# EAGLE design rgb_test_board_1 (EAGLE 9.5.2)
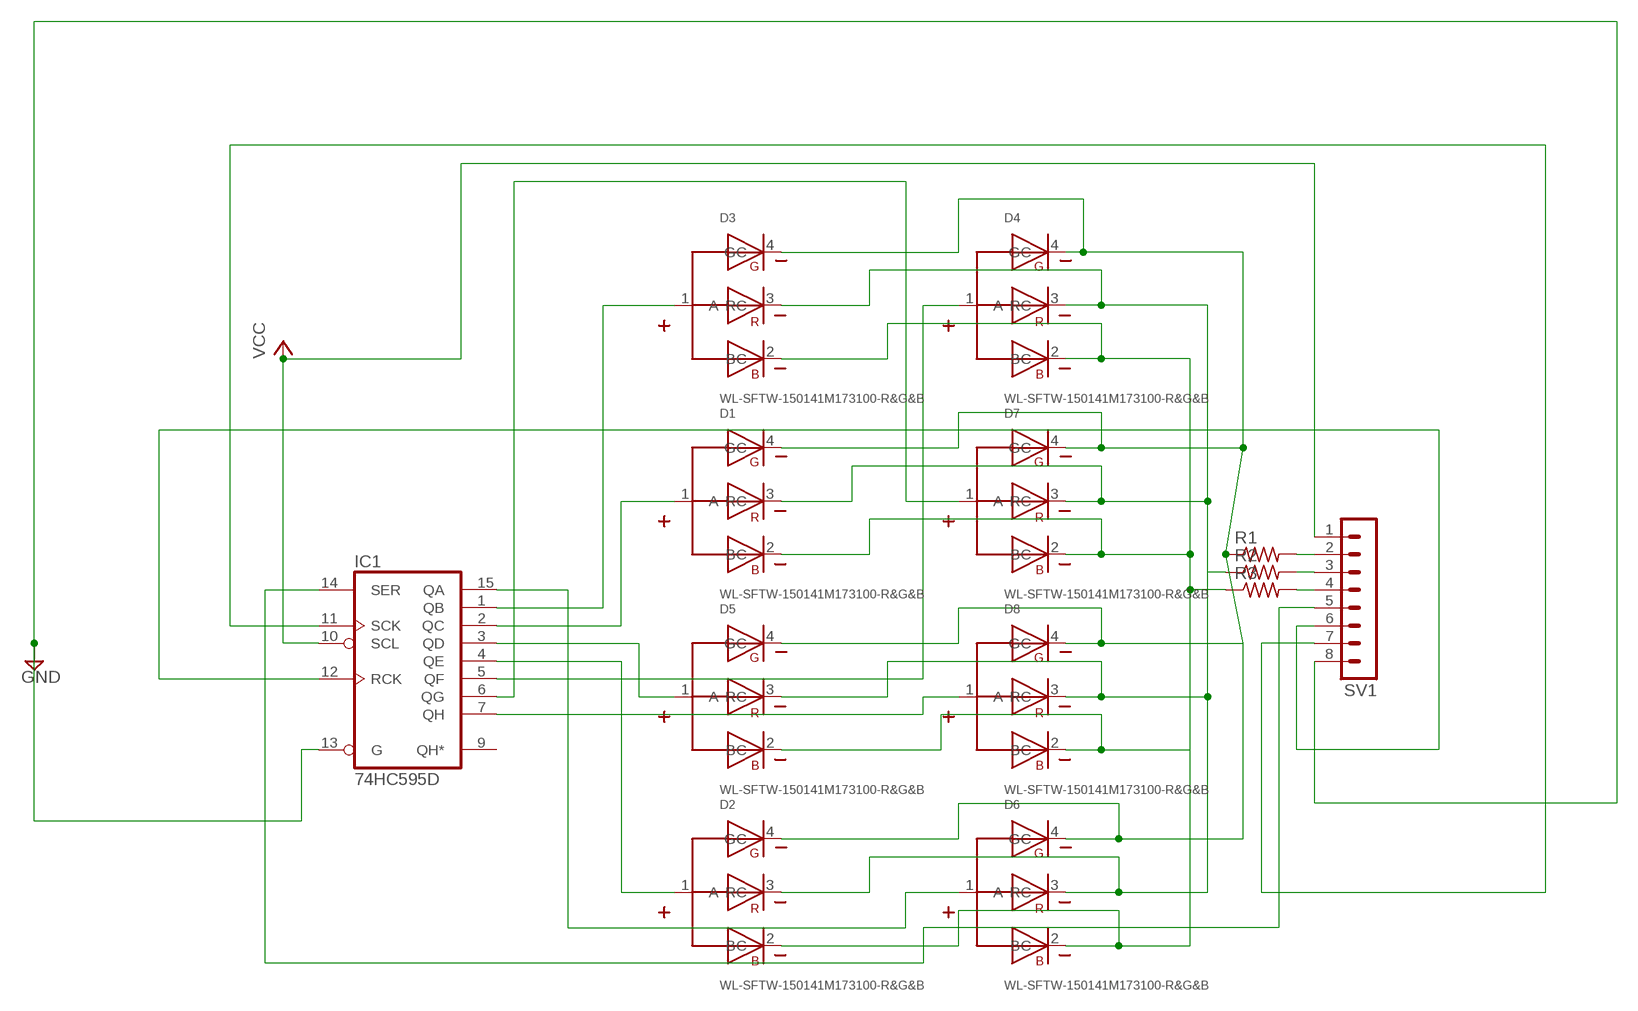
[diagram p0: schematic, sheet 1]

## Parts
D1  WL-SFTW-150141M173100-R&G&B  [3528-COMMON-ANODE]
D2  WL-SFTW-150141M173100-R&G&B  [3528-COMMON-ANODE]
D3  WL-SFTW-150141M173100-R&G&B  [3528-COMMON-ANODE]
D4  WL-SFTW-150141M173100-R&G&B  [3528-COMMON-ANODE]
D5  WL-SFTW-150141M173100-R&G&B  [3528-COMMON-ANODE]
D6  WL-SFTW-150141M173100-R&G&B  [3528-COMMON-ANODE]
D7  WL-SFTW-150141M173100-R&G&B  [3528-COMMON-ANODE]
D8  WL-SFTW-150141M173100-R&G&B  [3528-COMMON-ANODE]
IC1  74HC595D  [SO16]
R1  R-US_R0805  [R0805]
R2  R-US_R0805  [R0805]
R3  R-US_R0805  [R0805]
SV1  MA08-1  [MA08-1]

## Nets
GND: IC1.13(G) SV1.8
N$1: R1.2 SV1.2
N$2: R2.2 SV1.3
N$3: R3.2 SV1.4
N$4: D3.1(A) IC1.1(QB)
N$5: D1.1(A) IC1.2(QC)
N$6: D5.1(A) IC1.3(QD)
N$7: D2.1(A) IC1.4(QE)
N$8: D4.1(A) IC1.5(QF)
N$9: IC1.14(SER) SV1.5
N$10: D8.1(A) IC1.7(QH)
N$11: D1.4(GC) D2.4(GC) D3.4(GC) D4.4(GC) D5.4(GC) D6.4(GC) D7.4(GC) D8.4(GC) R1.1
N$12: IC1.12(RCK) SV1.6
N$13: D1.2(BC) D2.2(BC) D3.2(BC) D4.2(BC) D5.2(BC) D6.2(BC) D7.2(BC) D8.2(BC) R3.1
N$14: D6.1(A) IC1.15(QA)
N$15: D7.1(A) IC1.6(QG)
N$16: D1.3(RC) D2.3(RC) D3.3(RC) D4.3(RC) D5.3(RC) D6.3(RC) D7.3(RC) D8.3(RC) R2.1
N$17: IC1.11(SCK) SV1.7
VCC: IC1.10(SCL) SV1.1
Unconnected: IC1.9(QH*)

## Power pins joined to a net without a drawn wire
GND: IC1.8(GND)
VCC: IC1.16(VCC)

## Library data of the parts
D1-D8 = Wurth_Elektronik_Optoelectronics_rev15b:WL-SFTW: SMD full-color TOP LED Characteristics Low energy consumption High reliability Low current requirement Fast switching No UV/IR radiation High brightness RGB individual control Compact package outline Black surface Applications Flash light Switch indicators Equipments indicators Accent and decorative lighting Electronic signage Video displays Backlight for LCDs, PDAs and TVs Oven, microwave Street lighting Ideal for lateral coupling in light guides <http://katalog.we-online.de/media/images/eipal/WL-SFTW_pf2.jpg> Details see: http://katalog.we-online.de/en/led/WL-SFTW?m Updated 2015-04-10 2015 (C) Wurth Elektronik
IC1 = 74xx-eu:74*595: 8-bit SHIFT REGISTER, output latch
R1-R3 = rcl:R-US_: RESISTOR, American symbol; SPICEPREFIX: R
SV1 = con-lstb:MA08-1: PIN HEADER; OC_FARNELL: unknown; OC_NEWARK: unknown

## Board
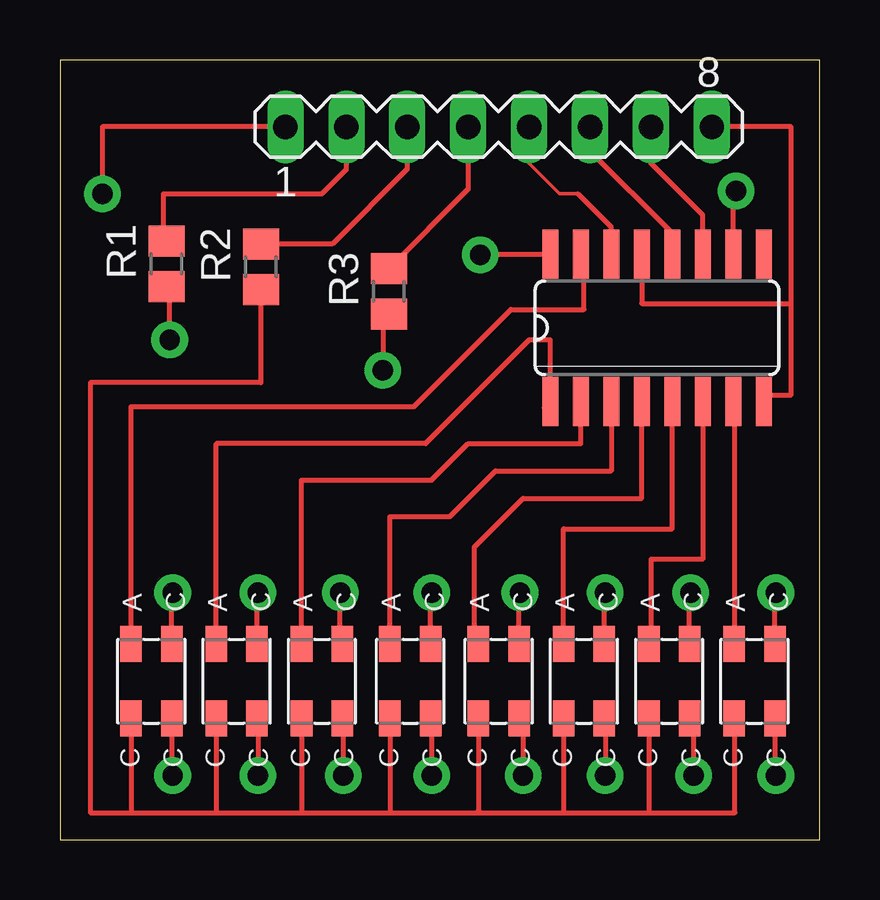
[diagram p1: board, top side]
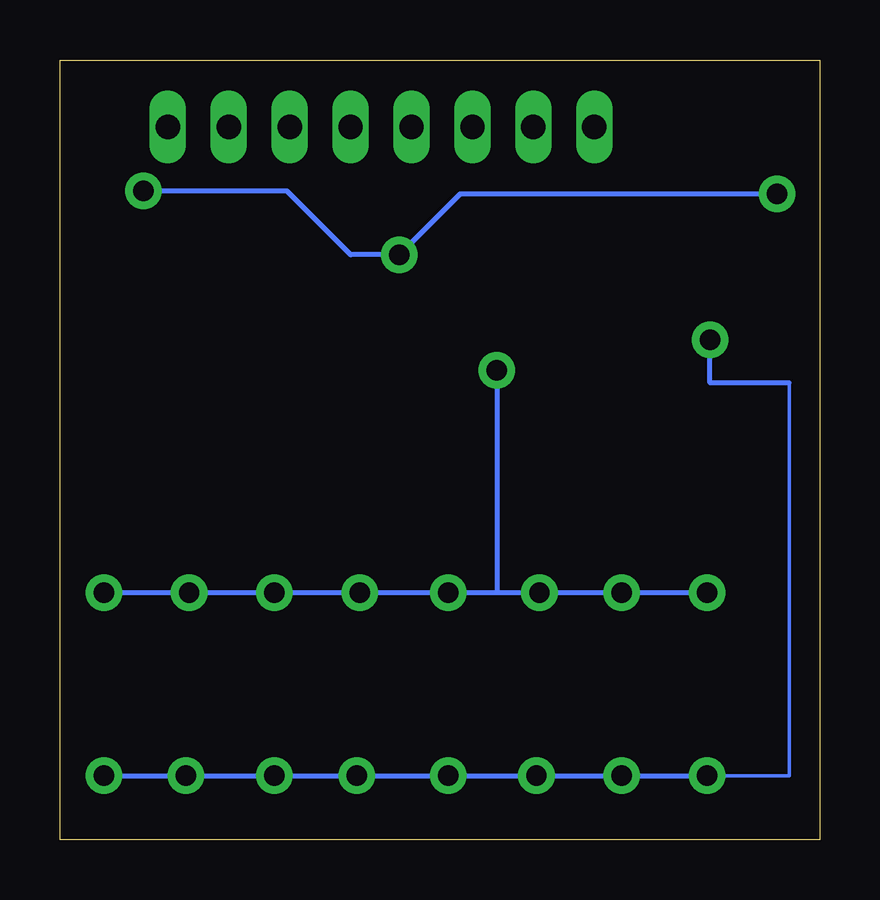
[diagram p2: board, bottom side, seen from below]

Size 31.67 x 32.5 mm. Coordinates in mm from the lower left corner, seen from the top.
Outline: 0,0 31.67,0 31.67,32.5 0,32.5 0,0
Copper layers (1*16): Top 0.035mm / dielectric 1.5mm / Bottom 0.035mm
Design rules "default": minimum track width 6mil, minimum drill 0.35mm, track to track 6mil, track to pad 6mil, pad to pad 6mil, via to via 6mil, smd to smd 6mil, copper to edge 40mil, drill to drill 6mil, minimum pad ring 10mil, minimum via ring 8mil, stop-mask expansion 4mil, vias tented up to drill 0mil, thermal gap 10mil

### Footprints (pad centres in the part's own frame; a part is rotated, then mirrored left to right if it is on the bottom)
3528-COMMON-ANODE = smd 1.5 x 0.9: 1 1.55,0.85; 2 1.55,-0.85; 3 -1.55,0.85; 4 -1.55,-0.85
SO16 = smd 0.66 x 2.032: 1 -4.445,-3.073; 2 -3.175,-3.073; 3 -1.905,-3.073; 4 -0.635,-3.073; 5 0.635,-3.073; 6 1.905,-3.073; 7 3.175,-3.073; 8 4.445,-3.073; 9 4.445,3.073; 10 3.175,3.073; 11 1.905,3.073; 12 0.635,3.073; 13 -0.635,3.073; 14 -1.905,3.073; 15 -3.175,3.073; 16 -4.445,3.073
R0805 = smd 1.3 x 1.5: 1 -0.95,0; 2 0.95,0
MA08-1 = drill 1.016 long: 1 -8.89,0; 2 -6.35,0; 3 -3.81,0; 4 -1.27,0; 5 1.27,0; 6 3.81,0; 7 6.35,0; 8 8.89,0

### Placement (x,y rotation side)
D1  10.92,6.6 90 top
D2  18.29,6.6 90 top
D3  7.37,6.6 90 top
D4  21.84,6.6 90 top
D5  14.61,6.6 90 top
D6  3.81,6.6 90 top
D7  25.4,6.6 90 top
D8  28.96,6.6 90 top
IC1  24.89,21.34 0 top
R1  4.45,24 90 top
R2  8.38,23.88 90 top
R3  13.72,22.86 90 top
SV1  18.29,29.72 0 top

### Tracks (layer width: path | path; a pad name or v marks a point on that pad's centre or on a via)
GND
  Top 0.203: IC1.8 29.62,18.54 30.48,18.54 30.48,22.35 | 30.48,22.35 30.48,29.72 SV1.8 | 24.38,24.28 IC1.13 24.26,22.35 30.48,22.35
N$1
  Top 0.203: R1.2 4.32,25.08 4.32,26.92 10.92,26.92 11.94,27.94 SV1.2
N$2
  Top 0.203: SV1.3 14.48,27.94 11.36,24.83 R2.2
N$3
  Top 0.203: SV1.4 17.02,27.11 R3.2
N$4
  Top 0.203: 20.19,18.01 IC1.1 20.45,20.83 19.56,20.83 15.24,16.51 6.52,16.51 D3.1
N$5
  Top 0.203: D1.1 10.07,14.99 15.49,14.99 17.02,16.51 21.72,16.51 IC1.2
N$6
  Top 0.203: 13.72,8.19 D5.1 13.75,13.46 16.26,13.46 18.16,15.37 22.99,15.37 IC1.3
N$7
  Top 0.203: D2.1 17.27,8.32 17.27,12.19 19.3,14.22 24.26,14.22 IC1.4
N$8
  Top 0.203: D4.1 20.99,12.95 25.53,12.95 IC1.5
N$9
  Top 0.152: SV1.5 19.56,28.19 20.83,26.92 21.59,26.92
  Top 0.203: IC1.14 22.99,25.53 21.59,26.92
N$10
  Top 0.203: IC1.7 28.11,18.22 D8.1
N$11  (via drill 0.85 pad 1.52)
  Top 0.203: 4.83,4.89 D6.4 4.66,2.71 v4.7,2.67 | v4.57,20.83 4.57,22.93 R1.1 | D3.4 8.25,5.02 v8.25,2.67 | D1.4 11.81,5.02 v11.81,2.67 | D5.4 15.49,5.02 v15.49,2.67 | D2.4 19.3,4.89 v19.3,2.67 | D4.4 22.73,5.02 v22.73,2.67 | D7.4 26.42,4.89 v26.42,2.67 | D8.4 29.81,2.71 v29.85,2.67
  Bottom 0.152: 1.27,19.05 1.27,2.67 v4.7,2.67
  Bottom 0.203: 1.27,19.05 4.57,19.05 v4.57,20.83 | v4.7,2.67 v8.25,2.67 v11.81,2.67 v15.49,2.67 v19.3,2.67 v22.73,2.67 v26.42,2.67 v29.85,2.67
N$12
  Top 0.203: IC1.12 25.53,25.27 22.1,28.7 SV1.6
N$13  (via drill 0.85 pad 1.52)
  Top 0.203: R3.1 13.46,21.66 v13.46,19.56 | D6.2 4.66,10.25 v4.7,10.29 | D3.2 8.22,10.25 v8.25,10.29 | D1.2 11.68,8.24 v11.68,10.29 | D5.2 15.46,10.25 v15.49,10.29 | D2.2 19.14,10.25 v19.18,10.29 | D4.2 22.69,10.25 v22.73,10.29 | D7.2 26.25,10.25 v26.29,10.29 | D8.2 29.81,10.25 v29.85,10.29
  Bottom 0.203: v4.7,10.29 v8.25,10.29 v11.68,10.29 v15.49,10.29 | v15.49,10.29 13.46,10.29 v13.46,19.56 | v15.49,10.29 v19.18,10.29 v22.73,10.29 v26.29,10.29 v29.85,10.29
N$14
  Top 0.203: D6.1 2.96,18.03 14.73,18.03 18.8,22.1 21.84,22.1 21.84,24.28 IC1.15
N$15
  Top 0.203: IC1.6 26.8,11.68 24.64,11.68 24.64,8.24 D7.1
N$16
  Top 0.203: 3.05,4.97 D6.3 2.96,1.16 2.92,1.12 | R2.1 8.38,19.05 1.27,19.05 1.27,1.12 2.92,1.12 | 28.19,4.97 28.14,5.02 | 28.14,5.02 D8.3 | 2.92,1.12 6.48,1.12 | 6.48,1.12 10.03,1.12 | 10.03,1.12 13.72,1.12 | 13.72,1.12 17.53,1.12 | 17.53,1.12 20.96,1.12 | 20.96,1.12 24.51,1.12 | 24.51,1.12 28.14,1.12 28.14,5.02 | D7.3 24.55,1.16 24.51,1.12 | D4.3 20.99,1.16 20.96,1.12 | D2.3 17.44,1.21 17.53,1.12 | D5.3 13.75,1.16 13.72,1.12 | D1.3 10.07,1.16 10.03,1.12 | D3.3 6.52,1.16 6.48,1.12
N$17
  Top 0.203: IC1.11 26.8,26.03 24.64,28.19 SV1.7
VCC  (via drill 0.85 pad 1.52)
  Top 0.203: IC1.16 20.42,24.38 v17.53,24.38 | v1.78,26.92 1.78,29.72 SV1.1 | IC1.10 28.07,27.18 v28.19,27.05
  Bottom 0.203: v1.78,26.92 14.99,26.92 v17.53,24.38 19.56,24.38 22.22,27.05 v28.19,27.05